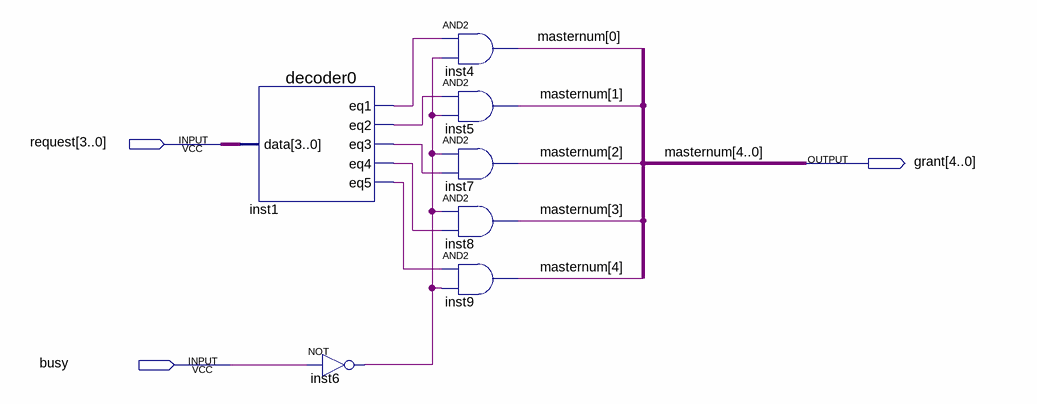
[diagram p0: schematic sheet]
// Quartus schematic bus_arbiter.bdf as structural Verilog: 7 symbols, 3 pins
module bus_arbiter (
  input  [3:0] request,
  input  busy,
  output [4:0] grant
);

  wire inst1_eq1, inst1_eq2, inst1_eq3, inst1_eq4, inst1_eq5, inst6_out;

  decoder0 inst1 (.data(request), .eq1(inst1_eq1), .eq2(inst1_eq2), .eq3(inst1_eq3), .eq4(inst1_eq4), .eq5(inst1_eq5));
  not inst6 (inst6_out, busy);
  and inst4 (grant[0], inst1_eq1, inst6_out);
  and inst5 (grant[1], inst1_eq2, inst6_out);
  and inst7 (grant[2], inst6_out, inst1_eq3);
  and inst8 (grant[3], inst6_out, inst1_eq4);
  and inst9 (grant[4], inst1_eq5, inst6_out);

  // Other names for the same wires on the sheet: masternum[4:0] = grant
endmodule
